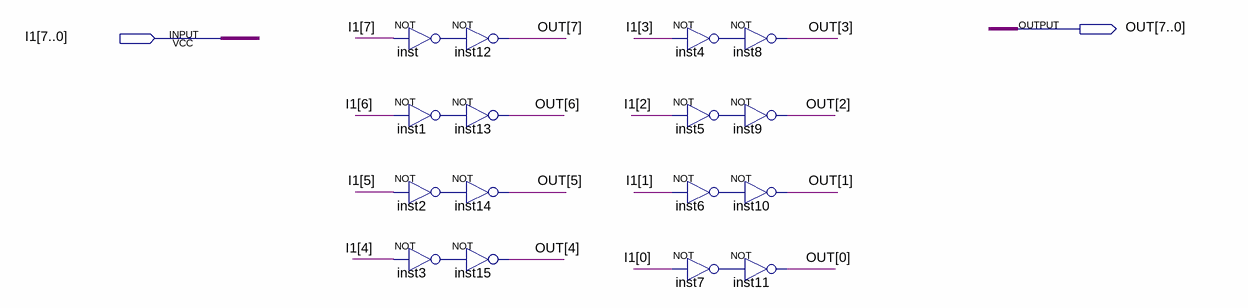
[diagram p0: schematic sheet]
// Quartus schematic NOTNOT8BIT.bdf as structural Verilog: 16 symbols, 2 pins
module NOTNOT8BIT (
  input  [7:0] I1,
  output [7:0] OUT
);

  wire inst1_out, inst2_out, inst3_out, inst4_out, inst5_out, inst6_out, inst7_out, inst_out;

  not inst (inst_out, I1[7]);
  not inst12 (OUT[7], inst_out);
  not inst1 (inst1_out, I1[6]);
  not inst13 (OUT[6], inst1_out);
  not inst2 (inst2_out, I1[5]);
  not inst14 (OUT[5], inst2_out);
  not inst3 (inst3_out, I1[4]);
  not inst15 (OUT[4], inst3_out);
  not inst4 (inst4_out, I1[3]);
  not inst5 (inst5_out, I1[2]);
  not inst6 (inst6_out, I1[1]);
  not inst7 (inst7_out, I1[0]);
  not inst8 (OUT[3], inst4_out);
  not inst9 (OUT[2], inst5_out);
  not inst10 (OUT[1], inst6_out);
  not inst11 (OUT[0], inst7_out);
endmodule
